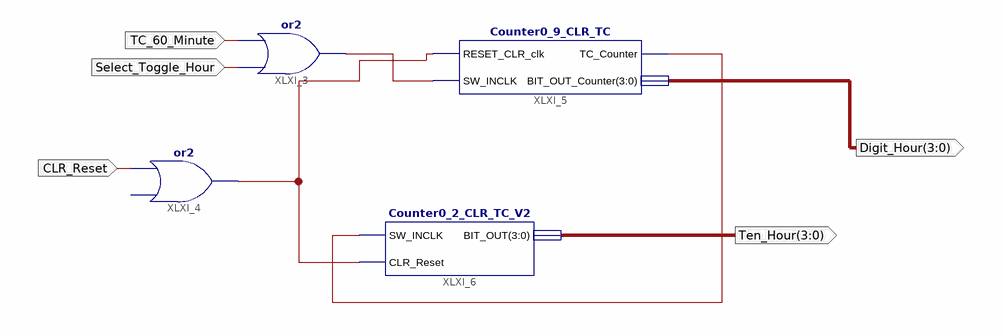
[diagram p0: schematic sheet 1]
// Xilinx ISE schematic Time_23_Hour.sch (spartan6) as structural Verilog: 4 symbols, 5 ports
module Time_23_Hour (
  input  TC_60_Minute,
  input  Select_Toggle_Hour,
  input  CLR_Reset,
  output [3:0] Ten_Hour,
  output [3:0] Digit_Hour
);

  wire XLXN_9, XLXN_26, XLXN_37;

  or XLXI_3 (XLXN_9, Select_Toggle_Hour, TC_60_Minute);
  buf XLXI_4 (XLXN_26, CLR_Reset);  // or2 open: I0
  Counter0_9_CLR_TC XLXI_5 (
    .BIT_OUT_Counter(Digit_Hour), .RESET_CLR_clk(XLXN_26), .SW_INCLK(XLXN_9), .TC_Counter(XLXN_37));
  Counter0_2_CLR_TC_V2 XLXI_6 (.BIT_OUT(Ten_Hour), .CLR_Reset(XLXN_26), .SW_INCLK(XLXN_37));
endmodule
